# EAGLE design 220v sensor (EAGLE 7.2.0)
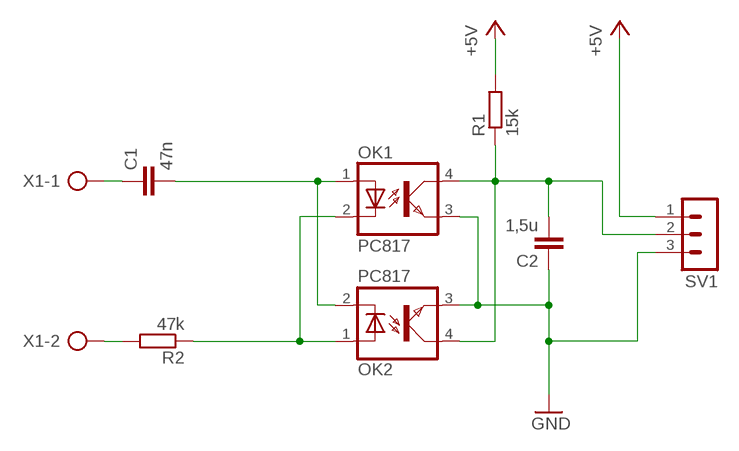
[diagram p0: schematic, sheet 1]

## Parts
C1  47n  C-EU075-032X103  [C075-032X103]
C2  1,5u  C-EU075-032X103  [C075-032X103]
OK1  PC817  [DIL04]
OK2  PC817  [DIL04]
R1  15k  R-EU_0207/15  [0207/15]
R2  47k  R-EU_0207/15  [0207/15]
SV1  MA03-1  [MA03-1]
X1  AK300/2  [AK300/2]

## Nets
+5V: R1.2 SV1.1
GND: C2.1 OK1.3(EMIT) OK2.3(EMIT) SV1.3
N$1 [220v]: OK1.2(C) OK2.1(A) R2.1
N$2 [220v]: C1.2 OK1.1(A) OK2.2(C)
N$6 [220v]: R2.2 X1.2
N$7 [220v]: C1.1 X1.1
N$8: C2.2 OK1.4(COL) OK2.4(COL) R1.1 SV1.2

## Library data of the parts
C1 C2 = resistor:C-EU: CAPACITOR, European symbol
OK1 OK2 = optocoupler:PC817: SHARP OPTO COUPLER; MPN: PC817X4J000F; OC_FARNELL: 9707727; OC_NEWARK: 97K7059
R1 R2 = resistor:R-EU_: RESISTOR, European symbol
SV1 = con-lstb:MA03-1: PIN HEADER; OC_FARNELL: unknown; OC_NEWARK: unknown
X1 = con-ptr500:AK300/2: CONNECTOR; OC_FARNELL: unknown; OC_NEWARK: unknown

## Net classes
0 default: width 1.143 mm, drill 1.651 mm
1 220v: width 1.397 mm, drill 1.651 mm

## Board
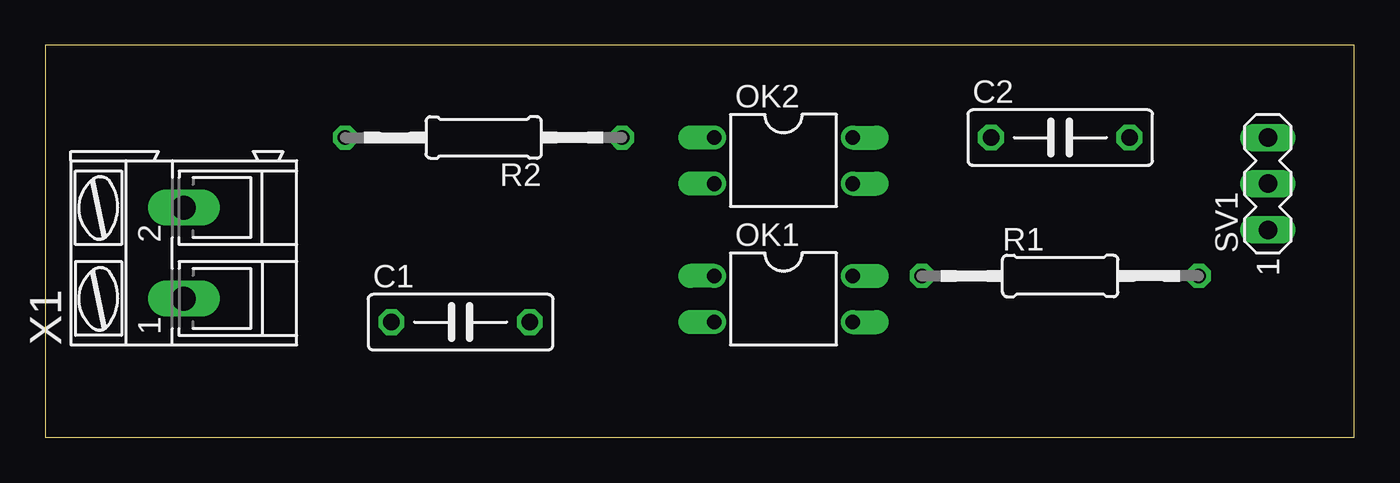
[diagram p1: board, top side]
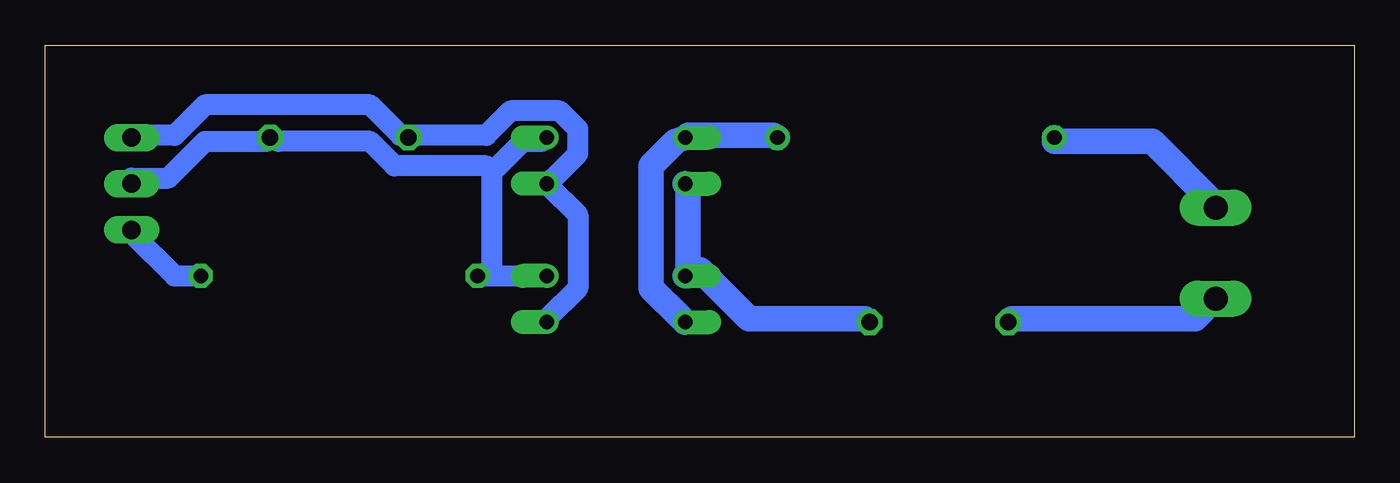
[diagram p2: board, bottom side, seen from below]

Size 72.06 x 21.58 mm. Coordinates in mm from the lower left corner, seen from the top.
Outline: 0,0 72.06,0 72.06,21.58 0,21.58 0,0
Copper layers (1*16): Top 0.035mm / dielectric 1.5mm / Bottom 0.035mm
Design rules "default": minimum track width 10mil, minimum drill 24mil, track to track 8mil, track to pad 8mil, pad to pad 8mil, via to via 8mil, smd to smd 8mil, copper to edge 40mil, drill to drill 8mil, minimum pad ring 10mil, minimum via ring 8mil, stop-mask expansion 4mil, vias tented up to drill 0mil, thermal gap 10mil

### Footprints (pad centres in the part's own frame; a part is rotated, then mirrored left to right if it is on the bottom)
C075-032X103 = drill 0.914 octagon: 1 -3.81,0; 2 3.81,0
DIL04 = drill 0.813 offset: 1 -1.27,-3.81; 2 1.27,-3.81; 3 1.27,3.81; 4 -1.27,3.81
0207/15 = drill 0.813 octagon: 1 -7.62,0; 2 7.62,0
MA03-1 = drill 1.016 long: 1 -2.54,0; 2 0,0; 3 2.54,0
AK300/2 = drill 1.321 long: 1 -2.515,0; 2 2.489,0

### Placement (x,y rotation side)
C1  22.86,6.35 0 top
C2  55.88,16.51 0 top
OK1  40.64,7.62 270 top
OK2  40.64,15.24 270 top
R1  55.88,8.89 0 top
R2  24.13,16.51 180 top
SV1  67.31,13.97 90 top
X1  7.62,10.16 90 top

### Tracks (layer width: path | path; a pad name or v marks a point on that pad's centre or on a via)
+5V
  Bottom 1.143: R1.2 64.95,8.89 67.31,11.25 SV1.1
GND
  Bottom 1.143: OK1.3 44.42,6.53 42.74,8.22 42.74,12.25 44.42,13.94 OK2.3 44.09,14.27 42.74,15.62 42.74,16.97 43.75,17.98 46.44,17.98 47.79,16.63 51.83,16.63 C2.1 52.5,16.63 54.19,18.31 63.27,18.31 64.95,16.63 67.31,16.63 SV1.3
N$1
  Bottom 1.397: R2.1 31.97,16.63 36.68,16.63 OK2.1 37.36,16.29 38.7,14.95 38.7,8.22 37.02,6.53 OK1.2
N$2
  Bottom 1.397: OK2.2 36.68,13.94 36.68,8.89 OK1.1 36.01,9.23 33.32,6.53 26.92,6.53 C1.2
N$6
  Bottom 1.397: R2.2 16.49,16.29 11.11,16.29 7.74,12.93 X1.2
N$7
  Bottom 1.397: C1.1 18.85,6.53 8.75,6.53 7.74,7.54 X1.1
N$8
  Bottom 1.143: SV1.2 67.31,14.27 65.29,14.27 63.27,16.29 59.91,16.29 C2.2 59.23,16.29 54.19,16.29 52.84,14.95 47.79,14.95 47.45,14.61 | R1.1 47.45,8.89 | 47.45,8.89 OK1.4 | 47.45,14.61 45.77,16.29 44.76,16.29 OK2.4 | 47.45,8.89 47.45,14.61